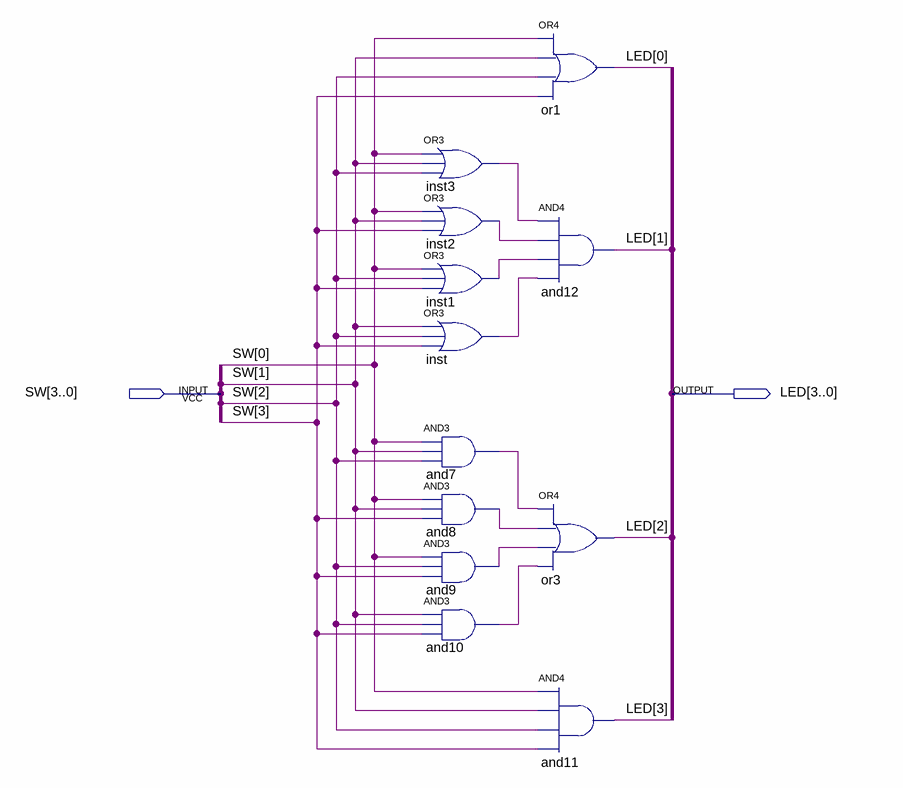
[diagram p0: schematic sheet]
// Quartus schematic SALIDA_LED.bdf as structural Verilog: 12 symbols, 2 pins
module SALIDA_LED (
  input  [3:0] SW,
  output [3:0] LED
);

  wire and7_out, and8_out, and9_out, and10_out, inst1_out, inst2_out, inst3_out, inst_out;

  or inst3 (inst3_out, SW[0], SW[1], SW[2]);
  or inst2 (inst2_out, SW[0], SW[1], SW[3]);
  or inst1 (inst1_out, SW[0], SW[2], SW[3]);
  or inst (inst_out, SW[1], SW[2], SW[3]);
  and and7 (and7_out, SW[0], SW[1], SW[2]);
  and and8 (and8_out, SW[0], SW[1], SW[3]);
  and and9 (and9_out, SW[0], SW[2], SW[3]);
  and and10 (and10_out, SW[1], SW[2], SW[3]);
  or or1 (LED[0], SW[0], SW[1], SW[2], SW[3]);
  and and12 (LED[1], inst3_out, inst2_out, inst1_out, inst_out);
  or or3 (LED[2], and7_out, and8_out, and9_out, and10_out);
  and and11 (LED[3], SW[0], SW[1], SW[2], SW[3]);
endmodule
